# Altium schematic sheet pca10112_sheet1_cover.SchDoc: Cover
size A3; Organization: Nordic Semiconductor; DocumentNumber: 1; SheetNumber: 1; SheetTotal: 7; CompanyName: Nordic Semiconductor
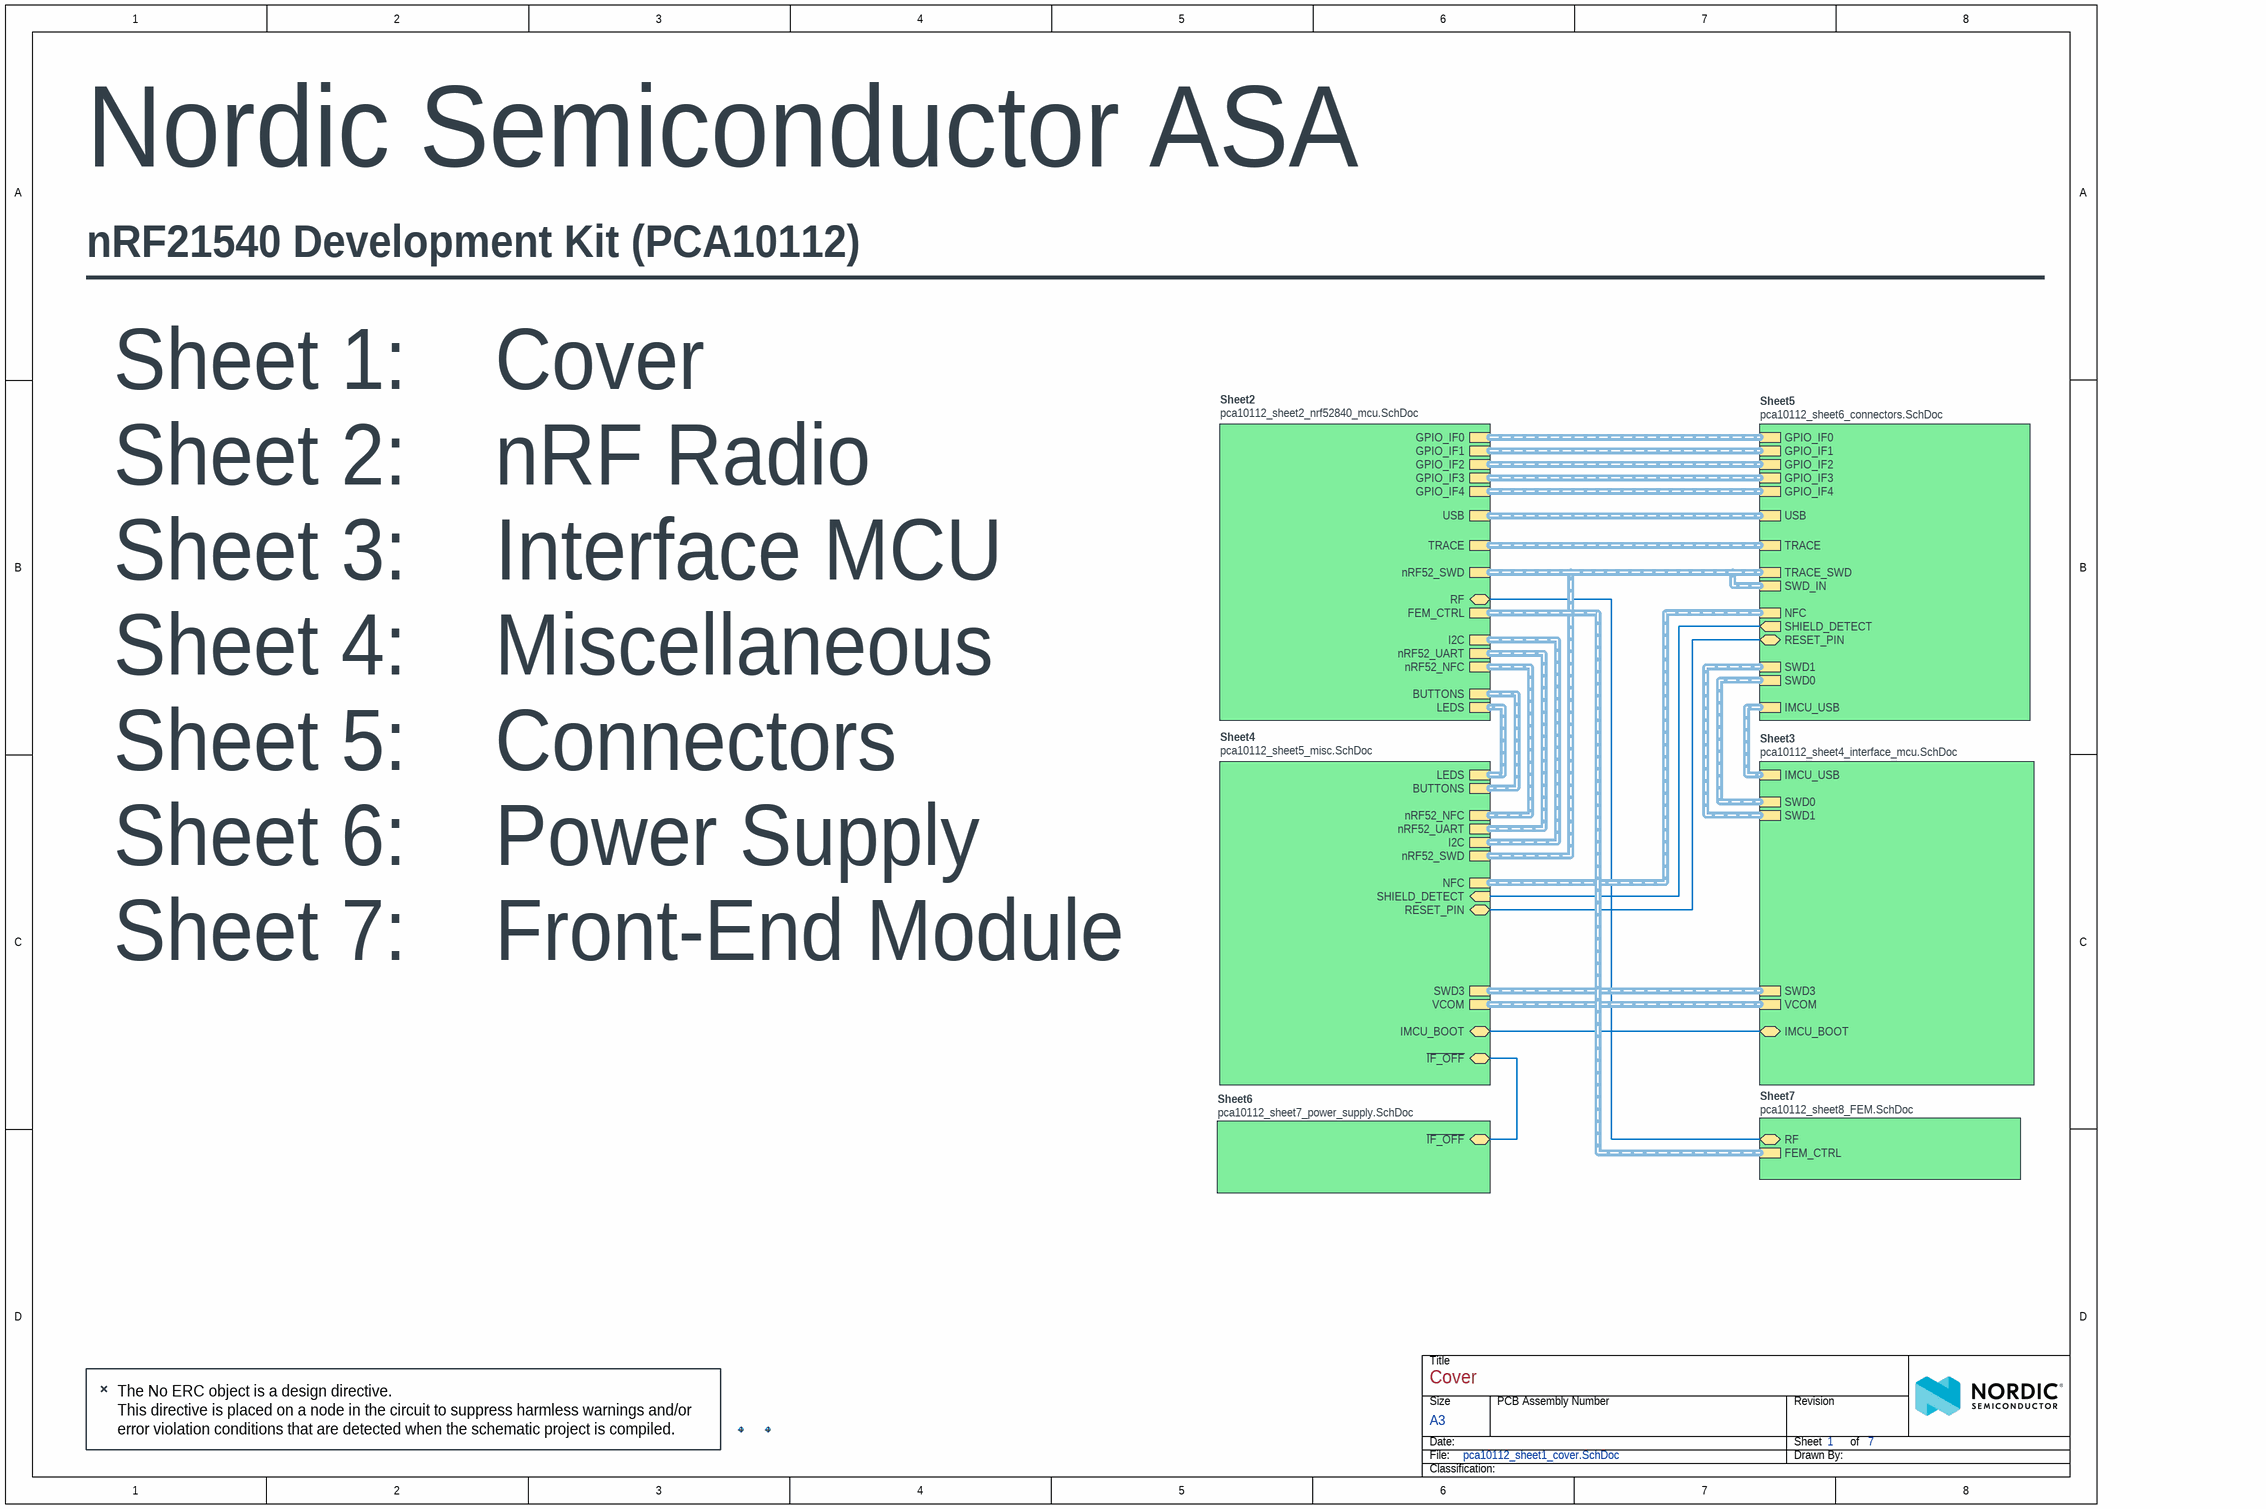
[diagram p0: pca10112_sheet1_cover.SchDoc]

## Parts
Fid1  Fiducial mark  [Fiducial]  (value not drawn)
Fid2  Fiducial mark  [Fiducial]  (value not drawn)

## Sub-sheets
Sheet2 = pca10112_sheet2_nrf52840_mcu.SchDoc: nRF52_UART (harness nRF52_UART), GPIO_IF1 (harness GPIO_IF1), GPIO_IF0 (harness GPIO_IF0), GPIO_IF4 (harness GPIO_IF4), nRF52_SWD (harness SWD), I2C (harness I2C), TRACE (harness TRACE), GPIO_IF2 (harness GPIO_IF2), GPIO_IF3 (harness GPIO_IF3), BUTTONS (harness BUTTONS), FEM_CTRL (harness FEM), USB (harness USB), LEDS (harness LED), RF (bidir), nRF52_NFC (harness NFC)
Sheet3 = pca10112_sheet4_interface_mcu.SchDoc: IMCU_BOOT (bidir), VCOM (harness UART), SWD3 (harness SWD), SWD0 (harness SWD), IMCU_USB (harness USB), SWD1 (harness SWD)
Sheet4 = pca10112_sheet5_misc.SchDoc: VCOM (harness UART), RESET_PIN (bidir), nRF52_SWD (harness SWD), BUTTONS (harness BUTTONS), nRF52_UART (harness nRF52_UART), IMCU_BOOT (bidir), LEDS (harness LED), I2C (harness I2C), NFC (harness NFC), ~{IF_OFF} (bidir), SHIELD_DETECT (in), SWD3 (harness SWD), nRF52_NFC (harness NFC)
Sheet5 = pca10112_sheet6_connectors.SchDoc: SWD0 (harness SWD), RESET_PIN (bidir), SWD1 (harness SWD), USB (harness USB), GPIO_IF4 (harness GPIO_IF4), GPIO_IF0 (harness GPIO_IF0), SHIELD_DETECT (out), GPIO_IF3 (harness GPIO_IF3), TRACE_SWD (harness SWD), IMCU_USB (harness USB), SWD_IN (harness SWD), TRACE (harness TRACE), GPIO_IF1 (harness GPIO_IF1), GPIO_IF2 (harness GPIO_IF2), NFC (harness NFC)
Sheet6 = pca10112_sheet7_power_supply.SchDoc: ~{IF_OFF} (bidir)
Sheet7 = pca10112_sheet8_FEM.SchDoc: FEM_CTRL (harness FEM), RF (bidir)

## Nets
(unnamed): sheet Sheet2/RF, sheet Sheet7/RF
(unnamed): sheet Sheet3/IMCU_BOOT, sheet Sheet4/IMCU_BOOT
(unnamed): sheet Sheet4/RESET_PIN, sheet Sheet5/RESET_PIN
(unnamed): sheet Sheet4/~{IF_OFF}, sheet Sheet6/~{IF_OFF}
(unnamed): sheet Sheet4/SHIELD_DETECT, sheet Sheet5/SHIELD_DETECT

## Buses and harness runs
harness sheet Sheet2/BUTTONS = sheet Sheet4/BUTTONS
harness sheet Sheet2/FEM_CTRL = sheet Sheet7/FEM_CTRL
harness sheet Sheet2/GPIO_IF0 = sheet Sheet5/GPIO_IF0
harness sheet Sheet2/GPIO_IF1 = sheet Sheet5/GPIO_IF1
harness sheet Sheet2/GPIO_IF2 = sheet Sheet5/GPIO_IF2
harness sheet Sheet2/GPIO_IF3 = sheet Sheet5/GPIO_IF3
harness sheet Sheet2/GPIO_IF4 = sheet Sheet5/GPIO_IF4
harness sheet Sheet2/I2C = sheet Sheet4/I2C
harness sheet Sheet2/LEDS = sheet Sheet4/LEDS
harness sheet Sheet2/nRF52_NFC = sheet Sheet4/nRF52_NFC
harness sheet Sheet2/nRF52_SWD = sheet Sheet4/nRF52_SWD = sheet Sheet5/SWD_IN = sheet Sheet5/TRACE_SWD
harness sheet Sheet2/nRF52_UART = sheet Sheet4/nRF52_UART
harness sheet Sheet2/TRACE = sheet Sheet5/TRACE
harness sheet Sheet2/USB = sheet Sheet5/USB
harness sheet Sheet3/IMCU_USB = sheet Sheet5/IMCU_USB
harness sheet Sheet3/SWD0 = sheet Sheet5/SWD0
harness sheet Sheet3/SWD1 = sheet Sheet5/SWD1
harness sheet Sheet3/SWD3 = sheet Sheet4/SWD3
harness sheet Sheet3/VCOM = sheet Sheet4/VCOM
harness sheet Sheet4/NFC = sheet Sheet5/NFC

## Notes on the sheet
- Nordic Semiconductor ASA
- nRF21540 Development Kit (PCA10112)
- ________________________________________________________________
- Sheet 1:    Cover
- Sheet 2:    nRF Radio
- Sheet 3:    Interface MCU
- Sheet 4:    Miscellaneous
- Sheet 5:    Connectors
- Sheet 6:    Power Supply
- Sheet 7:    Front-End Module
- (near Fid1) The No ERC object is a design directive.
  This directive is placed on a node in the circuit to suppress harmless warnings and/or error violation conditions that are detected when the schematic project is compiled.
- Title
- Size
- Date:
- File:
- A3
- PCB Assembly Number
- Sheet         of
- Drawn By:
- Revision
- Classification:

## Library data of the parts
Fid1 Fid2 = Fid-Mark: Manufacturer: N.A.; Part number NEMS: 100500073; Value: N.A.; Pad Count: 1; Component Status: Active; Part Number: Fid-Mark; Manufacturer Part Number: N.A.; LatestRevisionDate: 2009-12-12; Published: 2009-12-12; Note: N.A.; Artikkelnr Noca: N.A.; Footprint Doc: Fiducial; Part number IPS: N.A.; ComponentLink1URL: N.A.; ComponentLink1Description: Datasheet; ComponentLink2URL: N.A.; ComponentLink2Description: Supplier link; HelpURL: N.A.; Supplier 1: N.A.; Supplier Part Number 1: N.A.; Supplier 2: N.A.; Supplier Part Number 2: N.A.; Component Class: Connectors; PartId: 100500073; Author: rsk; Part number Norautron: N.A.